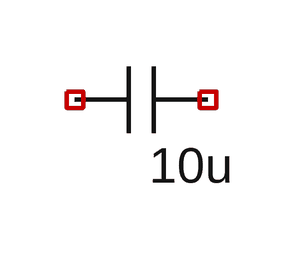
[diagram p0: schematic valid_05.asc]
valid_05.asc, the LTspice schematic file:
Version 4.1
SHEET 1 880 680
SYMBOL cap 10 20 M90
WINDOW 3 32 56 VTop 2
SYMATTR Value 10u
TEXT 0 64 Invisible 0 ;annotation

The netlist it stands for:
* valid_05.asc
C§? NC_01 NC_02 10u
* annotation
.backanno
.end